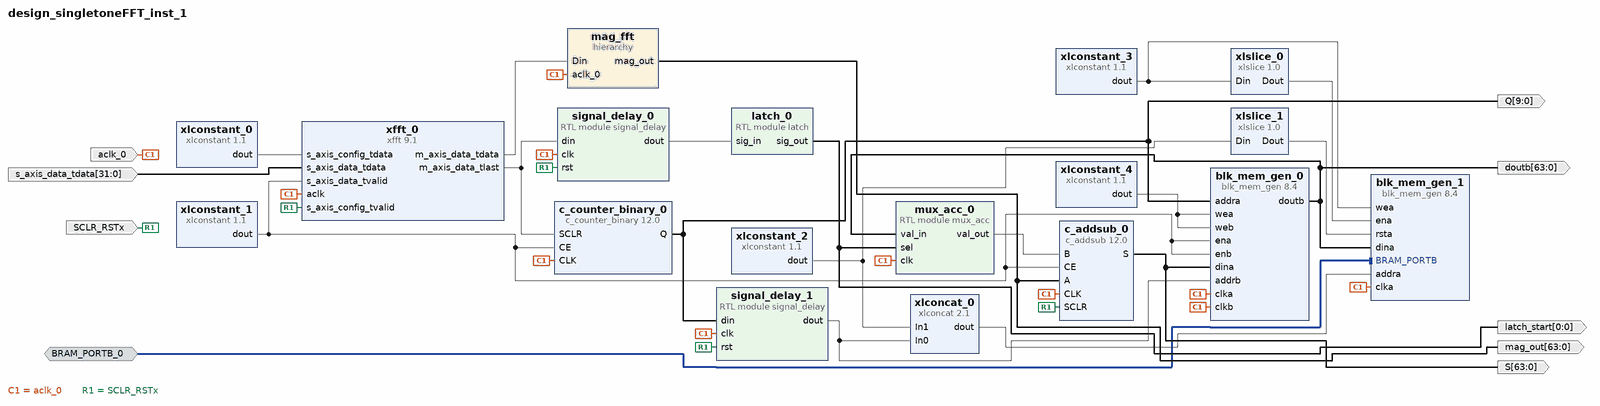
[diagram p0: block diagram of the top level]
# Vivado block design design_singletoneFFT_inst_1, xc7z010clg400-1, Vivado 2024.2
create_bd_design design_singletoneFFT_inst_1

create_bd_intf_port -mode Slave -vlnv xilinx.com:interface:bram_rtl:1.0 BRAM_PORTB_0
create_bd_port -dir I -type clk aclk_0
create_bd_port -dir I SCLR_RSTx
create_bd_port -dir I -from 31 -to 0 s_axis_data_tdata
create_bd_port -dir O -from 0 -to 0 latch_start
create_bd_port -dir O -from 63 -to 0 mag_out
create_bd_port -dir O -from 63 -to 0 doutb
create_bd_port -dir O -from 63 -to 0 -type data S
create_bd_port -dir O -from 9 -to 0 -type data Q

create_bd_cell -type ip -vlnv xilinx.com:ip:xfft:9.1 xfft_0
set_property -dict [list \
  CONFIG.implementation_options pipelined_streaming_io \
  CONFIG.input_width 16 \
  CONFIG.number_of_stages_using_block_ram_for_data_and_phase_factors 3 \
  CONFIG.scaling_options unscaled \
  CONFIG.target_clock_frequency 125 \
] [get_bd_cells xfft_0]
create_bd_cell -type hier mag_fft
create_bd_cell -type ip -vlnv xilinx.com:ip:blk_mem_gen:8.4 blk_mem_gen_0
set_property -dict [list \
  CONFIG.Assume_Synchronous_Clk false \
  CONFIG.Enable_B Use_ENB_Pin \
  CONFIG.Memory_Type True_Dual_Port_RAM \
  CONFIG.Operating_Mode_B WRITE_FIRST \
  CONFIG.Port_B_Clock 100 \
  CONFIG.Port_B_Enable_Rate 100 \
  CONFIG.Port_B_Write_Rate 50 \
  CONFIG.Read_Width_A 64 \
  CONFIG.Read_Width_B 64 \
  CONFIG.Register_PortA_Output_of_Memory_Primitives true \
  CONFIG.Register_PortB_Output_of_Memory_Primitives true \
  CONFIG.Use_RSTA_Pin false \
  CONFIG.Write_Depth_A 1024 \
  CONFIG.Write_Width_A 64 \
  CONFIG.Write_Width_B 64 \
  CONFIG.use_bram_block Stand_Alone \
] [get_bd_cells blk_mem_gen_0]
create_bd_cell -type ip -vlnv xilinx.com:ip:c_addsub:12.0 c_addsub_0
set_property -dict [list \
  CONFIG.A_Width 64 \
  CONFIG.B_Value 0000000000000000000000000000000000000000000000000000000000000000 \
  CONFIG.B_Width 64 \
  CONFIG.Latency 1 \
  CONFIG.Out_Width 64 \
  CONFIG.SCLR true \
] [get_bd_cells c_addsub_0]
create_bd_cell -type module -reference signal_delay signal_delay_1
set_property -dict {CONFIG.DELAY 4} [get_bd_cells signal_delay_1]
create_bd_cell -type module -reference mux_acc mux_acc_0
create_bd_cell -type module -reference signal_delay signal_delay_0
set_property -dict {CONFIG.DELAY 4 CONFIG.WIDTH 1} [get_bd_cells signal_delay_0]
create_bd_cell -type module -reference latch latch_0
create_bd_cell -type ip -vlnv xilinx.com:ip:xlconstant:1.1 xlconstant_0
set_property -dict {CONFIG.CONST_VAL 0 CONFIG.CONST_WIDTH 8} [get_bd_cells xlconstant_0]
create_bd_cell -type ip -vlnv xilinx.com:ip:xlconstant:1.1 xlconstant_4
set_property -dict {CONFIG.CONST_VAL 1 CONFIG.CONST_WIDTH 1} [get_bd_cells xlconstant_4]
create_bd_cell -type ip -vlnv xilinx.com:ip:c_counter_binary:12.0 c_counter_binary_0
set_property -dict {CONFIG.CE true CONFIG.Load false CONFIG.Output_Width 10 CONFIG.SCLR true} [get_bd_cells c_counter_binary_0]
create_bd_cell -type ip -vlnv xilinx.com:ip:xlconstant:1.1 xlconstant_1
create_bd_cell -type ip -vlnv xilinx.com:ip:blk_mem_gen:8.4 blk_mem_gen_1
set_property -dict [list \
  CONFIG.Memory_Type True_Dual_Port_RAM \
  CONFIG.Read_Width_A 64 \
  CONFIG.Write_Width_A 64 \
  CONFIG.use_bram_block BRAM_Controller \
] [get_bd_cells blk_mem_gen_1]
create_bd_cell -type ip -vlnv xilinx.com:ip:xlconstant:1.1 xlconstant_2
set_property -dict {CONFIG.CONST_VAL 0 CONFIG.CONST_WIDTH 22} [get_bd_cells xlconstant_2]
create_bd_cell -type ip -vlnv xilinx.com:ip:xlconcat:2.1 xlconcat_0
set_property -dict {CONFIG.IN0_WIDTH 10 CONFIG.IN1_WIDTH 22} [get_bd_cells xlconcat_0]
create_bd_cell -type ip -vlnv xilinx.com:ip:xlconstant:1.1 xlconstant_3
set_property -dict {CONFIG.CONST_WIDTH 8} [get_bd_cells xlconstant_3]
create_bd_cell -type ip -vlnv xilinx.com:ip:xlslice:1.0 xlslice_0
set_property -dict {CONFIG.DIN_WIDTH 8} [get_bd_cells xlslice_0]
create_bd_cell -type ip -vlnv xilinx.com:ip:xlslice:1.0 xlslice_1
set_property -dict {CONFIG.DIN_WIDTH 22} [get_bd_cells xlslice_1]

# ---- hierarchy /mag_fft ----
current_bd_instance /mag_fft
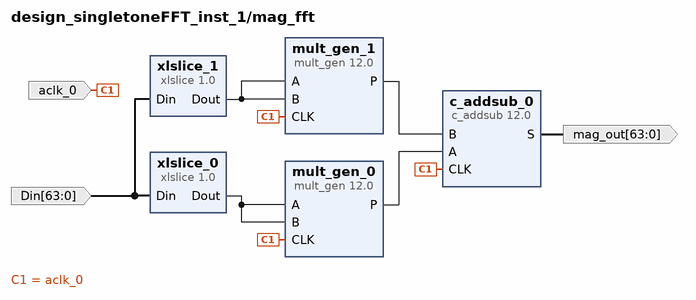
[diagram p1: block diagram inside /mag_fft]
create_bd_pin -dir I -type clk aclk_0
create_bd_pin -dir I -from 63 -to 0 Din
create_bd_pin -dir O -from 63 -to 0 mag_out

create_bd_cell -type ip -vlnv xilinx.com:ip:mult_gen:12.0 mult_gen_0
set_property -dict {CONFIG.PortAWidth 32 CONFIG.PortBWidth 32} [get_bd_cells mult_gen_0]
create_bd_cell -type ip -vlnv xilinx.com:ip:xlslice:1.0 xlslice_0
set_property -dict {CONFIG.DIN_FROM 63 CONFIG.DIN_TO 32 CONFIG.DIN_WIDTH 64 CONFIG.DOUT_WIDTH 32} [get_bd_cells xlslice_0]
create_bd_cell -type ip -vlnv xilinx.com:ip:xlslice:1.0 xlslice_1
set_property -dict {CONFIG.DIN_FROM 31 CONFIG.DIN_TO 0 CONFIG.DIN_WIDTH 64 CONFIG.DOUT_WIDTH 32} [get_bd_cells xlslice_1]
create_bd_cell -type ip -vlnv xilinx.com:ip:mult_gen:12.0 mult_gen_1
set_property -dict {CONFIG.PortAWidth 32 CONFIG.PortBWidth 32} [get_bd_cells mult_gen_1]
create_bd_cell -type ip -vlnv xilinx.com:ip:c_addsub:12.0 c_addsub_0
set_property -dict [list \
  CONFIG.A_Width 64 \
  CONFIG.B_Value 0000000000000000000000000000000000000000000000000000000000000000 \
  CONFIG.B_Width 64 \
  CONFIG.CE false \
  CONFIG.Implementation Fabric \
  CONFIG.Latency 1 \
  CONFIG.Out_Width 64 \
] [get_bd_cells c_addsub_0]

# ---- connections ----

current_bd_instance /mag_fft
connect_bd_net -net aclk_0_1 [get_bd_pins aclk_0] [get_bd_pins c_addsub_0/CLK] [get_bd_pins mult_gen_0/CLK] [get_bd_pins mult_gen_1/CLK]
connect_bd_net [get_bd_pins c_addsub_0/S] [get_bd_pins mag_out]
connect_bd_net [get_bd_pins mult_gen_0/P] [get_bd_pins c_addsub_0/A]
connect_bd_net [get_bd_pins mult_gen_1/P] [get_bd_pins c_addsub_0/B]
connect_bd_net -net xfft_0_m_axis_data_tdata [get_bd_pins Din] [get_bd_pins xlslice_0/Din] [get_bd_pins xlslice_1/Din]
connect_bd_net [get_bd_pins xlslice_0/Dout] [get_bd_pins mult_gen_0/A] [get_bd_pins mult_gen_0/B]
connect_bd_net [get_bd_pins xlslice_1/Dout] [get_bd_pins mult_gen_1/A] [get_bd_pins mult_gen_1/B]

current_bd_instance /
connect_bd_intf_net -intf_net BRAM_PORTB_0_1 [get_bd_intf_ports BRAM_PORTB_0] [get_bd_intf_pins blk_mem_gen_1/BRAM_PORTB]
connect_bd_net -net CommandLogic_Q_bram_acc [get_bd_pins c_counter_binary_0/Q] \
  [get_bd_pins blk_mem_gen_0/addra] [get_bd_pins signal_delay_1/din] [get_bd_ports Q]
connect_bd_net -net CommandLogic_bram_wea [get_bd_pins xlconstant_4/dout] [get_bd_pins blk_mem_gen_0/wea] [get_bd_pins blk_mem_gen_0/web]
connect_bd_net -net aclk_0_1 [get_bd_ports aclk_0] \
  [get_bd_pins mag_fft/aclk_0] [get_bd_pins blk_mem_gen_0/clka] [get_bd_pins blk_mem_gen_0/clkb] [get_bd_pins c_addsub_0/CLK] \
  [get_bd_pins xfft_0/aclk] [get_bd_pins mux_acc_0/clk] [get_bd_pins signal_delay_0/clk] [get_bd_pins signal_delay_1/clk] \
  [get_bd_pins c_counter_binary_0/CLK] [get_bd_pins blk_mem_gen_1/clka]
connect_bd_net [get_bd_pins blk_mem_gen_0/doutb] [get_bd_pins mux_acc_0/val_in] [get_bd_pins blk_mem_gen_1/dina] [get_bd_ports doutb]
connect_bd_net [get_bd_pins c_addsub_0/S] [get_bd_pins blk_mem_gen_0/dina] [get_bd_ports S]
connect_bd_net -net inputs_dout [get_bd_pins xlconstant_1/dout] \
  [get_bd_pins c_addsub_0/CE] [get_bd_pins xfft_0/s_axis_data_tvalid] [get_bd_pins blk_mem_gen_0/ena] \
  [get_bd_pins blk_mem_gen_0/enb] [get_bd_pins c_counter_binary_0/CE]
connect_bd_net -net inputs_dout_1 [get_bd_pins xlconstant_0/dout] [get_bd_pins xfft_0/s_axis_config_tdata]
connect_bd_net -net inputs_dout_2 [get_bd_ports SCLR_RSTx] \
  [get_bd_pins c_addsub_0/SCLR] [get_bd_pins xfft_0/s_axis_config_tvalid] [get_bd_pins signal_delay_0/rst] \
  [get_bd_pins signal_delay_1/rst]
connect_bd_net [get_bd_pins latch_0/sig_out] [get_bd_pins mux_acc_0/sel] [get_bd_ports latch_start]
connect_bd_net [get_bd_pins mag_fft/mag_out] [get_bd_pins c_addsub_0/A] [get_bd_ports mag_out]
connect_bd_net [get_bd_pins mux_acc_0/val_out] [get_bd_pins c_addsub_0/B]
connect_bd_net [get_bd_ports s_axis_data_tdata] [get_bd_pins xfft_0/s_axis_data_tdata]
connect_bd_net [get_bd_pins signal_delay_0/dout] [get_bd_pins latch_0/sig_in]
connect_bd_net [get_bd_pins signal_delay_1/dout] [get_bd_pins blk_mem_gen_0/addrb] [get_bd_pins xlconcat_0/In0]
connect_bd_net [get_bd_pins xfft_0/m_axis_data_tdata] [get_bd_pins mag_fft/Din]
connect_bd_net [get_bd_pins xfft_0/m_axis_data_tlast] [get_bd_pins signal_delay_0/din] [get_bd_pins c_counter_binary_0/SCLR]
connect_bd_net [get_bd_pins xlconcat_0/dout] [get_bd_pins blk_mem_gen_1/addra]
connect_bd_net [get_bd_pins xlconstant_2/dout] [get_bd_pins xlconcat_0/In1] [get_bd_pins xlslice_1/Din]
connect_bd_net [get_bd_pins xlconstant_3/dout] [get_bd_pins blk_mem_gen_1/wea] [get_bd_pins xlslice_0/Din]
connect_bd_net [get_bd_pins xlslice_0/Dout] [get_bd_pins blk_mem_gen_1/ena]
connect_bd_net [get_bd_pins xlslice_1/Dout] [get_bd_pins blk_mem_gen_1/rsta]

validate_bd_design
save_bd_design
